# Altium project USB-IRIS-W1.PrjPcb
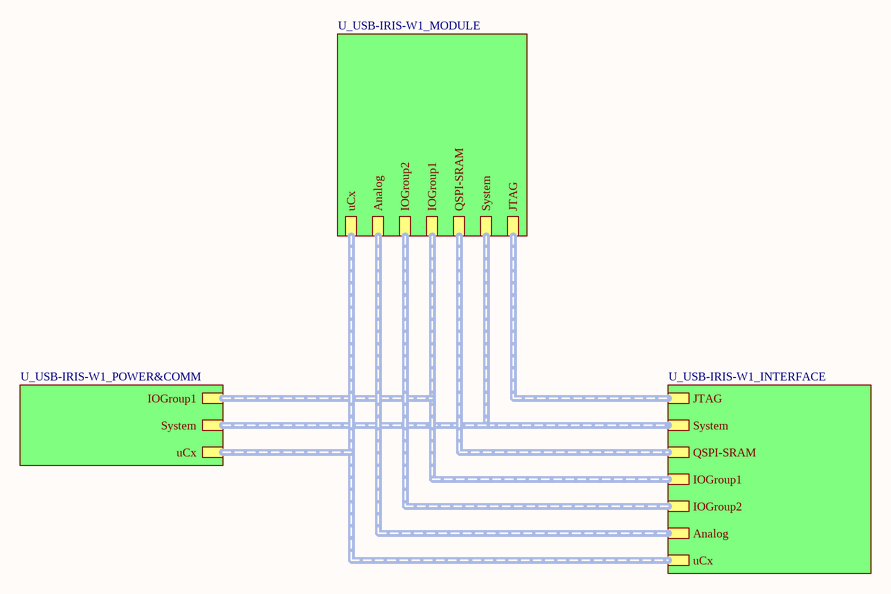
[diagram p0: USB-IRIS-W1_TOP_01.SchDoc]
SchUBXNum: UBXH66-000xxxx; SchSheetTotal: 4; SchDocNum: 4; ReleaseRev3: C; ReleaseRev2: B; ReleaseRev1: A; ReleaseDesc3: Corrected I2C-SCL and I2C-SDA connections at R5 and R18. 0201 to 0402.; ReleaseDesc2: Prototype Release; ReleaseDesc1: Prototype Release; ReleaseDate3: 2023-10-20; ReleaseDate2: 2023-06-02; ReleaseDate1: 2022-10-17; ReleaseBy3: lkis; ReleaseBy2: lkis; ReleaseBy1: lkis; ProjectEngineer: lkis; PCBUBXNum: UBXH60-0001068; PCBName: PCB-USB-IRIS-W1; PCBDocNum: UBXH60-0001068; GlobalReleaseDate: 2023-10-20; GlobalProjectTeam: ae-sho; GlobalProjectRevision: C; GlobalProjectName: USB-IRIS-W1; GlobalProjectLink: www.u-blox.com; GlobalProjectDescription: IRIS-W1 USB EVK Design; GlobalProjectCode: TE_IW1; GlobalCompanyName: u-blox AG; GlobalClientName: u-blox; AssemblyUBXNum: UBXH23-000xxxx
4 sheets, 87 parts. Net scope: hierarchical (ports join the sheet entries above them; power ports are global).
Board file: USB-IRIS-W1.PcbDoc
Sheets:
  USB-IRIS-W1_TOP_01.SchDoc
    U_USB-IRIS-W1_INTERFACE = USB-IRIS-W1_INTERFACE.SchDoc
    U_USB-IRIS-W1_MODULE = USB-IRIS-W1_MODULE.SchDoc
    U_USB-IRIS-W1_POWER&COMM = USB-IRIS-W1_POWER&COMM.SchDoc

## Sheet USB-IRIS-W1_TOP_01.SchDoc: PCB-USB-NORA-W1
size A3; Date: 09/17/2021; CompanyName: U-Blox; DrawnBy: ASOH/HEKF; Engineer: ASOH/HEKF; Organization: U-Blox; Address1: Östra Varvsgatan 4; Address2: SE-211 75 Malmo; DocumentNumber: 1; SheetNumber: 1; SheetTotal: 4; SheetSize: B; SheetTitle: TopSheet

### Sub-sheets
U_USB-IRIS-W1_INTERFACE = USB-IRIS-W1_INTERFACE.SchDoc: JTAG (harness JTAG), QSPI-SRAM (harness QSPI-SRAM), IOGroup2 (harness IOGroup2), Analog (harness Analog), uCx (harness uCx), IOGroup1 (harness IOGroup1), System (harness System)
U_USB-IRIS-W1_MODULE = USB-IRIS-W1_MODULE.SchDoc: JTAG (harness JTAG), QSPI-SRAM (harness QSPI-SRAM), IOGroup2 (harness IOGroup2), Analog (harness Analog), uCx (harness uCx), IOGroup1 (harness IOGroup1), System (harness System)
U_USB-IRIS-W1_POWER&COMM = USB-IRIS-W1_POWER&COMM.SchDoc: uCx (harness uCx), System (harness System), IOGroup1 (harness IOGroup1)

### Buses and harness runs
harness sheet U_USB-IRIS-W1_INTERFACE/Analog = sheet U_USB-IRIS-W1_MODULE/Analog
harness sheet U_USB-IRIS-W1_INTERFACE/IOGroup1 = sheet U_USB-IRIS-W1_MODULE/IOGroup1 = sheet U_USB-IRIS-W1_POWER&COMM/IOGroup1
harness sheet U_USB-IRIS-W1_INTERFACE/IOGroup2 = sheet U_USB-IRIS-W1_MODULE/IOGroup2
harness sheet U_USB-IRIS-W1_INTERFACE/JTAG = sheet U_USB-IRIS-W1_MODULE/JTAG
harness sheet U_USB-IRIS-W1_INTERFACE/QSPI-SRAM = sheet U_USB-IRIS-W1_MODULE/QSPI-SRAM
harness sheet U_USB-IRIS-W1_INTERFACE/System = sheet U_USB-IRIS-W1_MODULE/System = sheet U_USB-IRIS-W1_POWER&COMM/System
harness sheet U_USB-IRIS-W1_INTERFACE/uCx = sheet U_USB-IRIS-W1_MODULE/uCx = sheet U_USB-IRIS-W1_POWER&COMM/uCx

### Notes on the sheet
- Rev.
- Description
- Schematic/Assembly Revision
- Date
- By
- Prepared By
- Revision:
- CONFIDENTIAL
- Page:
- Size:
- A3

## Sheet USB-IRIS-W1_INTERFACE.SchDoc
size A3; Date: 7/24/2020; CompanyName: U-blox; DrawnBy: EMOO; Engineer: EMOO; Organization: U-blox; Address1: 3950 Fairview Industrial Dr SE #100; Address2: Salem, OR 97302; DocumentNumber: 3; SheetNumber: 3; SheetTotal: 4; SheetSize: B; SheetTitle: Connectors
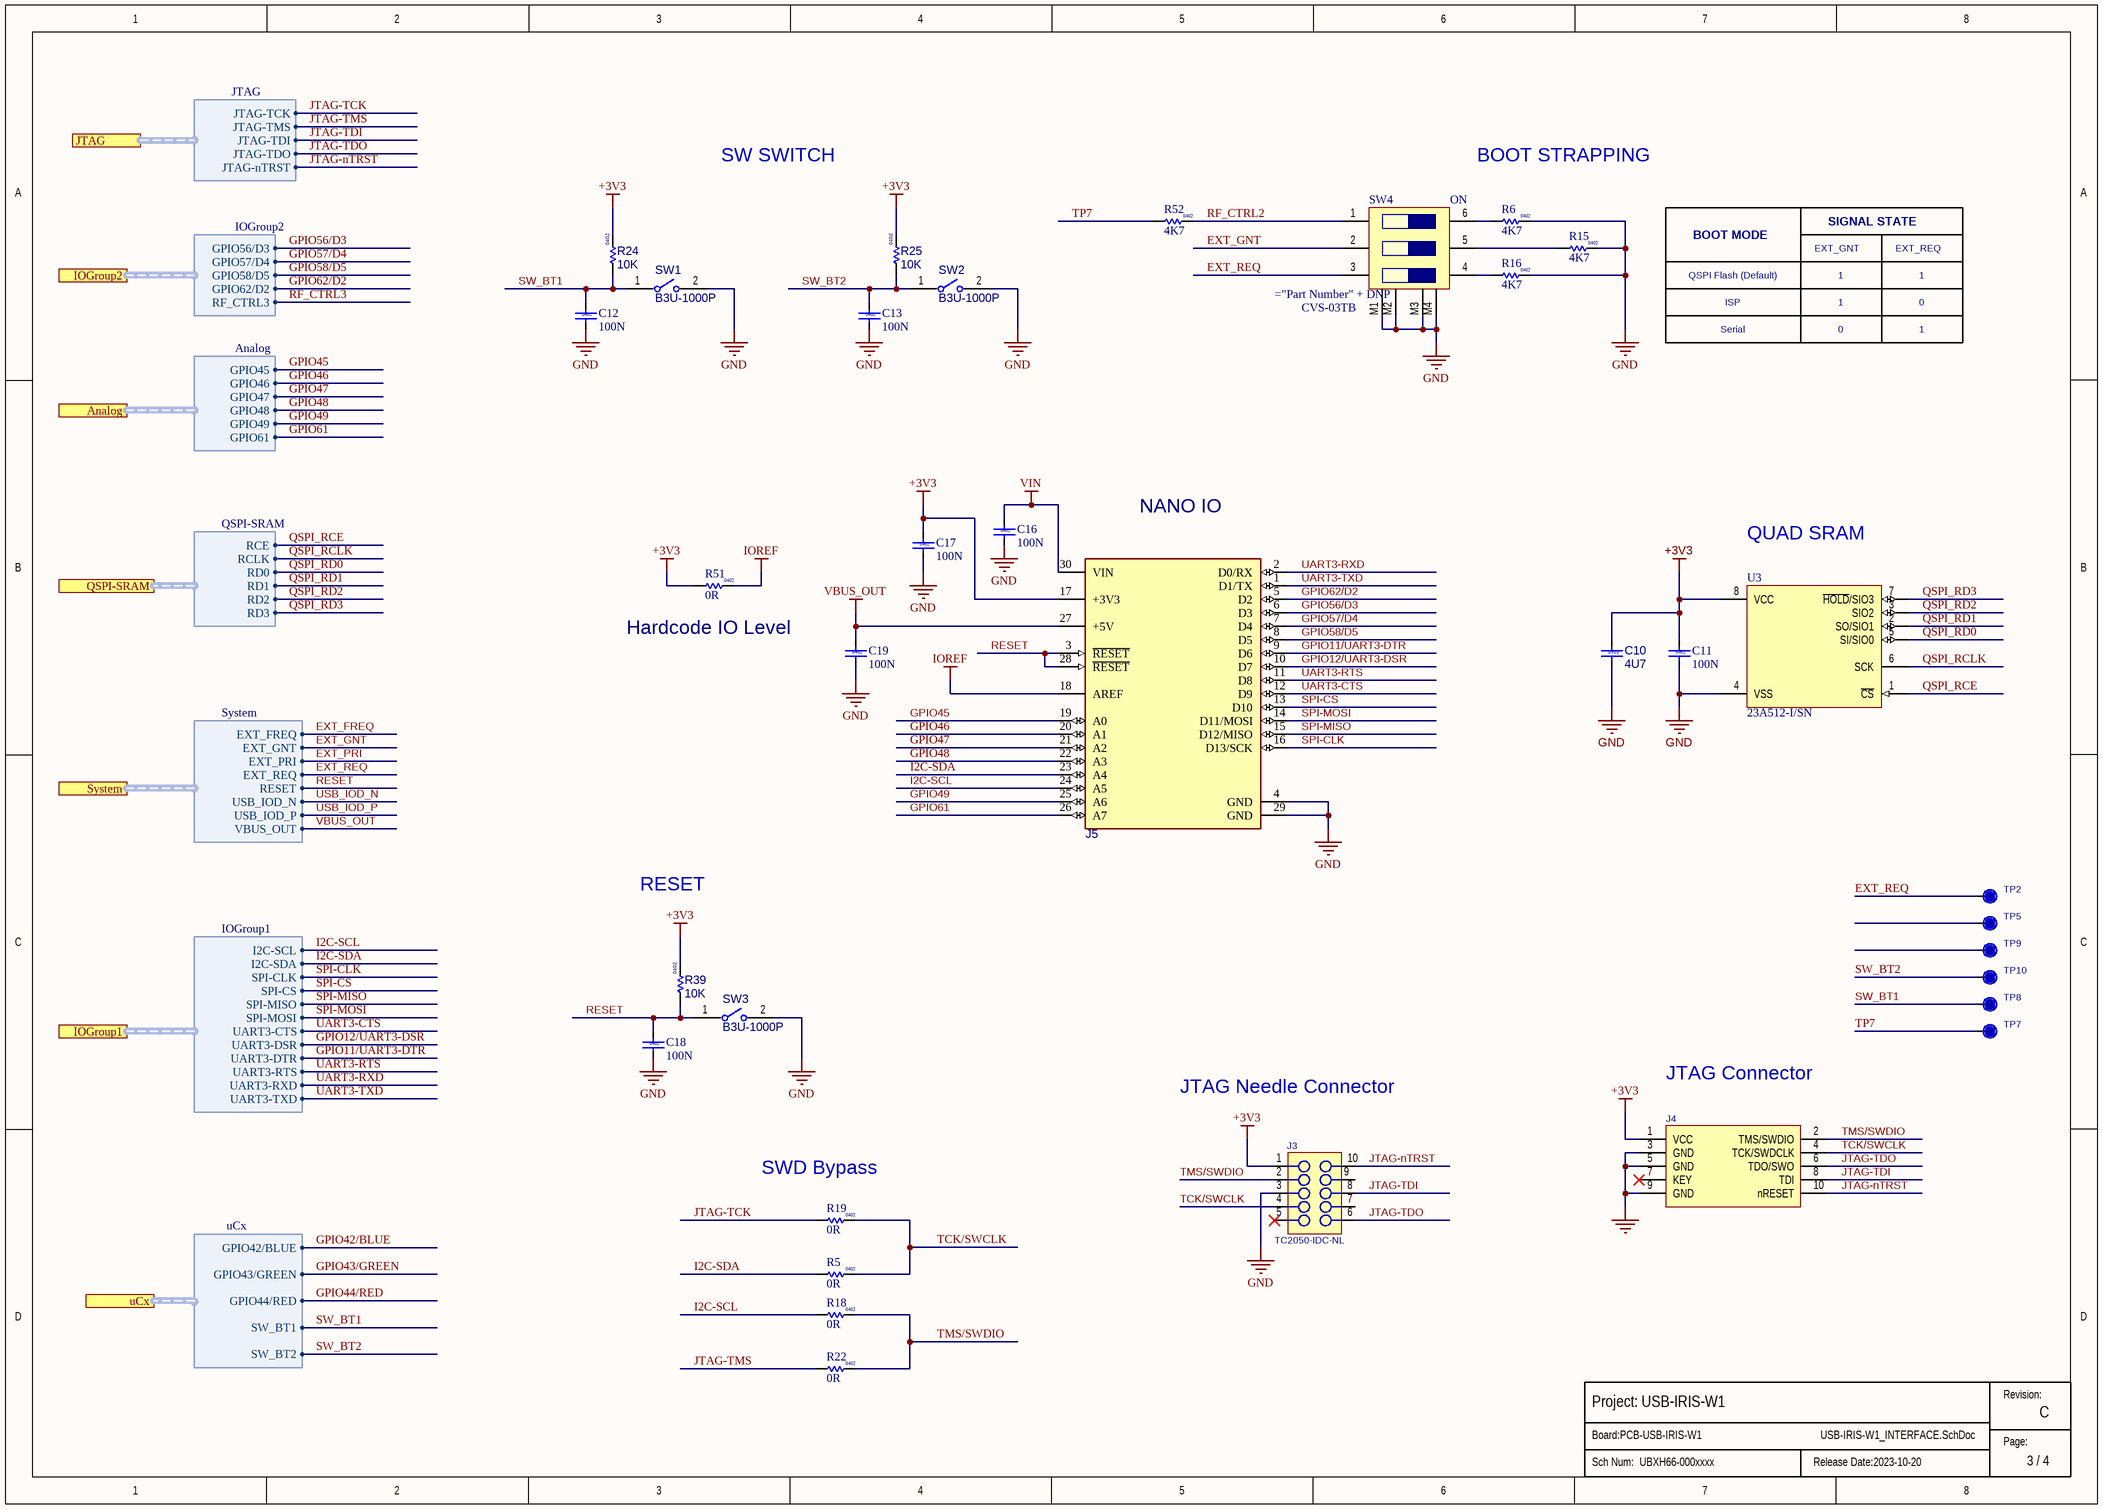
[diagram p1: USB-IRIS-W1_INTERFACE.SchDoc]

### Parts
C10  value 4U7  Size: 0x0y  [Cap 0402 HD]  (no BOM)
C11  value 100N  Size: 0402  [Cap 0402 HD]
C12  value 100N  Size: 0402  [Cap 0402]
C13  value 100N  Size: 0402  [Cap 0402]
C16  value 100N  Size: 0402  [Cap 0402 HD]
C17  value 100N  Size: 0402  [Cap 0402 HD]
C18  value 100N  Size: 0402  [Cap 0402]
C19  value 100N  Size: 0402  [Cap 0402 HD]
J3  TC2050-IDC-NLDNP  [TC2050-IDC-NL]  (value not drawn)  (no BOM)
J4  130-00099  [HDR.050P-10Pin-2x5-SMT_Key]  (value not drawn)
J5  UNK_Arduino  [UNK_Arduino]  (value not drawn)
R5  value 0R  Size: 0402  [RES_0402_1100Lx600Wx400H_500x600Pad_400G_FLX]
R6  value 4K7  Size: 0402  [RES_0402_1100Lx600Wx400H_500x600Pad_400G_FLX]
R15  value 4K7  Size: 0402  [RES_0402_1100Lx600Wx400H_500x600Pad_400G_FLX]
R16  value 4K7  Size: 0402  [RES_0402_1100Lx600Wx400H_500x600Pad_400G_FLX]
R18  value 0R  Size: 0402  [RES_0402_1100Lx600Wx400H_500x600Pad_400G_FLX]
R19  value 0R  Size: 0402  [RES_0402_1100Lx600Wx400H_500x600Pad_400G_FLX]
R22  value 0R  Size: 0402  [RES_0402_1100Lx600Wx400H_500x600Pad_400G_FLX]
R24  value 10K  Size: 0402  [RES 0402 HD]
R25  value 10K  Size: 0402  [RES 0402 HD]
R39  value 10K  Size: 0402  [RES 0402 HD]
R51  value 0R  Size: 0402  [RES_0402_1100Lx600Wx400H_500x600Pad_400G_FLX]
R52  value 4K7  Size: 0402  [RES_0402_1100Lx600Wx400H_500x600Pad_400G_FLX]
SW1  B3U-1000P  [FP-B3U-1000P-MFG]
SW2  B3U-1000P  [FP-B3U-1000P-MFG]
SW3  B3U-1000P  [FP-B3U-1000P-MFG]
SW4  (no value)  [CVS-03]
TP2  TP  [TP10R]  (value not drawn)  (no BOM)
TP5  TP  [TP10R]  (value not drawn)  (no BOM)
TP7  TP  [TP10R]  (value not drawn)  (no BOM)
TP8  TP  [TP10R]  (value not drawn)  (no BOM)
TP9  TP  [TP10R]  (value not drawn)  (no BOM)
TP10  TP  [TP10R]  (value not drawn)  (no BOM)
U3  23A512-I/SN  [SOIC127P599X173-8N]  (no BOM)

### Ports
Analog (harness Analog), IOGroup1 (harness IOGroup1), IOGroup2 (harness IOGroup2), JTAG (harness JTAG), QSPI-SRAM (harness QSPI-SRAM), System (harness System), uCx (harness uCx)

### Harnesses
JTAG: JTAG-TCK, JTAG-TMS, JTAG-TDI, JTAG-TDO, JTAG-nTRST
QSPI-SRAM: RCE, RCLK, RD0, RD1, RD2, RD3
IOGroup2: GPIO56/D3, GPIO57/D4, GPIO58/D5, GPIO62/D2, RF_CTRL3
Analog: GPIO45, GPIO46, GPIO47, GPIO48, GPIO49, GPIO61
uCx: GPIO42/BLUE, GPIO43/GREEN, GPIO44/RED, SW_BT1, SW_BT2
IOGroup1: I2C-SCL, I2C-SDA, SPI-CLK, SPI-CS, SPI-MISO, SPI-MOSI, UART3-CTS, UART3-DSR, UART3-DTR, UART3-RTS, UART3-RXD, UART3-TXD
System: EXT_FREQ, EXT_GNT, EXT_PRI, EXT_REQ, RESET, USB_IOD_N, USB_IOD_P, VBUS_OUT

### Nets
+3V3: C10.1 C11.1 C17.1 J3.1 J4.1(VCC) J5.17(+3V3) R24.2 R25.2 R39.2 R51.1 U3.8(VCC)
GND: C10.2 C11.2 C12.2 C13.2 C16.2 C17.2 C18.2 C19.2 J3.3 J4.3(GND) J4.5(GND) J4.9(GND) J5.4(GND) J5.29(GND) R6.2 R15.2 R16.2 SW1.2 SW2.2 SW3.2 SW4.M1 SW4.M2 SW4.M3 SW4.M4 U3.4(VSS)
IOREF: J5.18(AREF) R51.2
VBUS_OUT: C19.1 J5.27(+5V) ; port System.VBUS_OUT
VIN: C16.1 J5.30(VIN)
EXT_GNT: SW4.2 ; port System.EXT_GNT
EXT_REQ: SW4.3 TP2.1 ; port System.EXT_REQ
GPIO11/UART3-DTR: J5.9(D6) ; port IOGroup1.UART3-DTR
GPIO12/UART3-DSR: J5.10(D7) ; port IOGroup1.UART3-DSR
GPIO45: J5.19(A0) ; port Analog.GPIO45
GPIO46: J5.20(A1) ; port Analog.GPIO46
GPIO47: J5.21(A2) ; port Analog.GPIO47
GPIO48: J5.22(A3) ; port Analog.GPIO48
GPIO49: J5.25(A6) ; port Analog.GPIO49
GPIO56/D3: J5.6(D3) ; port IOGroup2.GPIO56/D3
GPIO57/D4: J5.7(D4) ; port IOGroup2.GPIO57/D4
GPIO58/D5: J5.8(D5) ; port IOGroup2.GPIO58/D5
GPIO61: J5.26(A7) ; port Analog.GPIO61
GPIO62/D2: J5.5(D2) ; port IOGroup2.GPIO62/D2
I2C-SCL: J5.24(A5) R18.1 ; port IOGroup1.I2C-SCL
I2C-SDA: J5.23(A4) R5.1 ; port IOGroup1.I2C-SDA
JTAG-nTRST: J3.10 J4.10(nRESET) ; port JTAG.JTAG-nTRST
JTAG-TCK: R19.1 ; port JTAG.JTAG-TCK
JTAG-TDI: J3.8 J4.8(TDI) ; port JTAG.JTAG-TDI
JTAG-TDO: J3.6 J4.6(TDO/SWO) ; port JTAG.JTAG-TDO
JTAG-TMS: R22.1 ; port JTAG.JTAG-TMS
QSPI_RCE: U3.1(~{CS}) ; port QSPI-SRAM.RCE
QSPI_RCLK: U3.6(SCK) ; port QSPI-SRAM.RCLK
QSPI_RD0: U3.5(SI/SIO0) ; port QSPI-SRAM.RD0
QSPI_RD1: U3.2(SO/SIO1) ; port QSPI-SRAM.RD1
QSPI_RD2: U3.3(SIO2) ; port QSPI-SRAM.RD2
QSPI_RD3: U3.7(~{HOLD}/SIO3) ; port QSPI-SRAM.RD3
RESET: C18.1 J5.3(~{RESET}) J5.28(~{RESET}) R39.1 SW3.1 ; port System.RESET
RF_CTRL2: R52.2 SW4.1
SPI-CLK: J5.16(D13/SCK) ; port IOGroup1.SPI-CLK
SPI-CS: J5.13(D10) ; port IOGroup1.SPI-CS
SPI-MISO: J5.15(D12/MISO) ; port IOGroup1.SPI-MISO
SPI-MOSI: J5.14(D11/MOSI) ; port IOGroup1.SPI-MOSI
SW_BT1: C12.1 R24.1 SW1.1 TP8.1 ; port uCx.SW_BT1
SW_BT2: C13.1 R25.1 SW2.1 TP10.1 ; port uCx.SW_BT2
TCK/SWCLK: J3.4 J4.4(TCK/SWDCLK) R5.2 R19.2
TMS/SWDIO: J3.2 J4.2(TMS/SWDIO) R18.2 R22.2
TP7: R52.1 TP7.1
UART3-CTS: J5.12(D9) ; port IOGroup1.UART3-CTS
UART3-RTS: J5.11(D8) ; port IOGroup1.UART3-RTS
UART3-RXD: J5.2(D0/RX) ; port IOGroup1.UART3-RXD
UART3-TXD: J5.1(D1/TX) ; port IOGroup1.UART3-TXD
NetR6_1: R6.1 SW4.6
NetR15_1: R15.1 SW4.5
NetR16_1: R16.1 SW4.4

Not connected (* = marked no-connect by the designer): J3 5* 7 9; J4 7(KEY)*; TP5 1; TP9 1

### Notes on the sheet
- SW SWITCH
- BOOT STRAPPING
- BOOT MODE
- EXT_GNT
- SIGNAL STATE
- EXT_REQ
- QSPI Flash (Default)
- ISP
- 1
- 0
- Serial
- NANO IO
- QUAD SRAM
- (near R51) Hardcode IO Level
- RESET
- JTAG Needle Connector
- JTAG Connector
- (near R19) SWD Bypass
- Revision:
- Page:
- (in symbol CVS-03TB) ON

### Library data of the parts
C10 = UBXH01-0000243: CAP CER X5R 0402; Manufacturer: Murata Manufacturing Company, Ltd.; Manufacturer P/N: GRM155R61A475MEAA; Tolerance: 20%; Max Voltage: 10.0V; Editor: dario.antonaz; Released by: pasquale.scorca; Env: ROHS; Permitted Use: Volume Products; Perferred: PREF; Mfg P/N Status: Active; Mfg P/N Split: 100; Mfg P/N Released: Yes; Part Number: UBXH01-0000243; Min Operating Temp: -40°C; Max Operating Temp: 85°C; Part Type: Capacitor; Release Data: 2016-03-17 10:02:21.014314; UBX Wiki: https://wiki.u-blox.com/bin/view/Operations/PartDetails?index=24303; RefDes: C; Mfg P/N Datasheet: https://wiki.u-blox.com/bin/view/Generic/Docs/DocumentSummary?index=24302
C11-C13 C16-C19 = UBXH01-2021002: CAP CER X5R 0402 100N 10% 10V; Manufacturer: Murata Manufacturing Company, Ltd.; Manufacturer P/N: GRM155R61A104KA01; Editor: roland.rust; Env: GREEN; Permitted Use: Volume Products; Perferred: PREF; Mfg P/N Status: NRND; Mfg P/N Split: 100; Mfg P/N Released: Yes; Part Number: UBXH01-2021002; Tolerance: 10%; Max Voltage: 10V; Part Type: Capacitor; Released by: roland.rust; Release Data: 2005-07-22T13:59:44; UBX Wiki: https://wiki.u-blox.com/bin/view/Operations/PartDetails?index=5759; RefDes: C; Manufacturer 2: Samsung Electro-Mechanics; Manufacturer P/N 2: CL05A104KP5NNN; Mfg P/N Status 2: Active; Mfg P/N Split 2: 0; Mfg P/N Released 2: Yes; Mfg P/N Datasheet 2: https://wiki.u-blox.com/bin/view/Generic/Docs/DocumentSummary?index=28113
J3 = TC2050-IDC-NL: CON PADS FOR CBL PLUG-OF-NAILS 10-PIN NO LEGS; Manufacturer: TAG Connect; Added By: Paul B; Manufacturer P/N: TC2050-IDC-NL; Part Number: TC2050-IDC-NL; Size: 6.1mm x 9.9mm; Height: 0; DNP: DNP; Added Date: 12/3/2015
J4 = 130-00099: Header 0.05" 10Pin 2Row SMD Black; Part Name: CON HDR 0.05" 10Pin 2Row SMD Black; Part_Type: Connector; Manufacturer: Samtec; Manufacturer P/N: FTSH-105-01-F-DV-K; Item_Phase: Pre-Production; Component Mounting Type: SMT; Keyed: Yes; Locking: No; Pin Pitch: 0.050"; Rows: 2; Part Number: 130-00099; Revision: 1; Supplier 1: Digi-Key; Supplier Part Number 1: SAM8796-ND; Arena Link: https://app.bom.com/a/5N6EKRARATS7TSHL?v=spec.summary; Color: Black; Connector Type: Header; Height: 6mm; Length: 12.75mm; Pins: 10; Use in new designs: Yes; Width: 4.78
J5 = UBXH04-0000717: ARDUINO NANO 33 IOT CONN; Editor: aneeb.sohail; Env: ROHS; Permitted Use: Support Products; Perferred: PREF; Part Number: UBXH04-0000717; Min Operating Temp: -40°C; Max Operating Temp: 85°C; Part Type: Connector; UBX Wiki: https://wiki.u-blox.com/bin/view/Operations/PartDetails?index=35490; RefDes: J
R5 R18 R19 R22 R51 = UBXH18-0003002: RES THICK FILM CHIP 0402 0R 0 100mW; Manufacturer: KOA; Manufacturer P/N: RK73Z1ETTD; Tolerance: 0; Editor: charlotte.biber; Released by: peter.mueller; Env: ROHS; Permitted Use: Volume Products; Perferred: PREF; Mfg P/N Status: NRND; Mfg P/N Split: 100; Mfg P/N Released: Yes; Part Number: UBXH18-0003002; Max Power: 100mW; Part Type: Resistor; Release Data: 2012-06-05T09:49:55; UBX Wiki: https://wiki.u-blox.com/bin/view/Operations/PartDetails?index=6611; RefDes: R; Manufacturer 2: YAGEO; Manufacturer P/N 2: 2322_705_91001_L; Mfg P/N Status 2: Obsolete; Mfg P/N Split 2: 0; Mfg P/N Released 2: Yes
R6 R15 R16 R52 = UBXH18-0008065: RES THICK FILM CHIP 0402 4K7 5% 100mW; Manufacturer: YAGEO; Manufacturer P/N: 2322_705_70472_L; Editor: martin.frauchiger; Env: ROHS; Permitted Use: Volume Products; Perferred: PREF; Mfg P/N Status: NRND; Mfg P/N Split: 100; Mfg P/N Released: Yes; Part Number: UBXH18-0008065; Tolerance: 5%; Max Power: 100mW; Part Type: Resistor; Released by: martin.frauchiger; Release Data: 2005-08-19T10:42:45; UBX Wiki: https://wiki.u-blox.com/bin/view/Operations/PartDetails?index=6969; RefDes: R; Manufacturer 2: KOA; Manufacturer P/N 2: RK73B1ETTD472J; Mfg P/N Status 2: NRND; Mfg P/N Split 2: 0; Mfg P/N Released 2: Yes
R24 R25 R39 = UBXH18-0008073: RES THICK FILM CHIP 0402 10K 5% 100mW; Manufacturer: YAGEO; Manufacturer P/N: 2322_705_87103_L; Editor: martin.frauchiger; Env: ROHS; Permitted Use: Volume Products; Perferred: PREF; Mfg P/N Status: NRND; Mfg P/N Split: 0; Mfg P/N Released: Yes; Part Number: UBXH18-0008073; Tolerance: 5%; Max Power: 100mW; Part Type: Resistor; Released by: martin.frauchiger; Release Data: 2005-08-19 10:42:45; UBX Wiki: https://wiki.u-blox.com/bin/view/Operations/PartDetails?index=6981; RefDes: R
SW1-SW3 = CMP-2100-03586-2: SWITCH TACTILE SPST-NO 0.05A 12V; Contact Resistance: 100mR; Operating Force: 1.5N; Max Current Rating: 50mA; Switch Travel: 0.15mm; Actuator Type: Standard; Mechanical Life: 200000Cycles; Ratings: Dust Proof; Illumination Type: Non-Illuminated; Throw Configuration: SPST; Actuator Length: 0.4mm; Switch Function: Off-Mom; Height: 1.2mm; Width: 3mm; Weight: 0.000776oz; Contact Material: Silver; Max Voltage Rating (DC): 12V; Insulation Resistance: 100MR; Lead Free: Lead Free; Current Rating: 50mA; Termination: SMD/SMT; Length: 4mm; Voltage Rating (DC): 12V; Contact Current Rating: 50mA; Orientation: Straight; Depth: 2.5mm; Max Operating Temperature: 70°C; Packaging: Tape and Reel; Min Operating Temperature: -25°C; Package Quantity: 1; Mount: Surface Mount; Electrical Life: 200000Cycles
SW4 = CVS-03TB: Dip Switch SPST 3 Position Surface Mount Slide (Standard) Actuator 100mA 6VDC; Part Number: UBXH19-0000036; Manufacturer 1: Nidec Components Corporation; Item_Phase: Active; Component Mounting Type: SMT; Switch/Button Function: On-Off; Use in new designs: Yes; Voltage: 6V; Item Phase: Unreleased; UBX Code: None; Part Name: CVS-03TB; Part_Type: Switch; Revision: A; Supplier 1: Digi-Key; Supplier Part Number 1: 563-1194-1-ND; Arena Link: https://app.bom.com/a/4M5DJQ9Q9SR7OCE3?v=spec.summary; Current: 100mA; Height: 1.45mm; Length: 6.1mm; Pins: 6; Switch/Button Circuit: SPST; Width: 6.2mm; Max Operating Temp: 85; Min Operating Temp: -40; Manufacturer 2: None; Manufacturer Part Number 2: None; Supplier 2: None; Supplier Part Number 2: None; Manufacturer Part Number 1: CVS-03TB
TP2 TP5 TP7-TP10 = TP10R: Testpoint, Round 1.0mm Dia; Added By: Jeremy D; Part Number: TP10R; Size: 1.0mm; Height: 0; DNP: DNP; Added Date: 2/1/2015; Checked By: Paul B; Checked Date: 2/5/2015
U3 = 23A512-I/SN: IC SRAM 512KBIT SPI/QUAD 8SOIC; Manufacturer: Microchip Technology; Memory Size: 512kb; Memory Interface: Qaud SPI; Manufacturer Part Number: 23A512-I/SN; Technology: SRAM; Package / Case: 8-SOIC (0.154", 3.90mm Width); Supplier 1: Digi-Key; Supplier Part Number 1: 23A512-I/SN-ND

## Sheet USB-IRIS-W1_MODULE.SchDoc
size A3; Date: 7/24/2020; CompanyName: U-blox; DrawnBy: EMOO; Engineer: EMOO; Organization: U-blox; Address1: 3950 Fairview Industrial Dr SE #100; Address2: Salem, OR 97302; DocumentNumber: 3; SheetNumber: 4; SheetTotal: 4; SheetSize: B; SheetTitle: Connectors
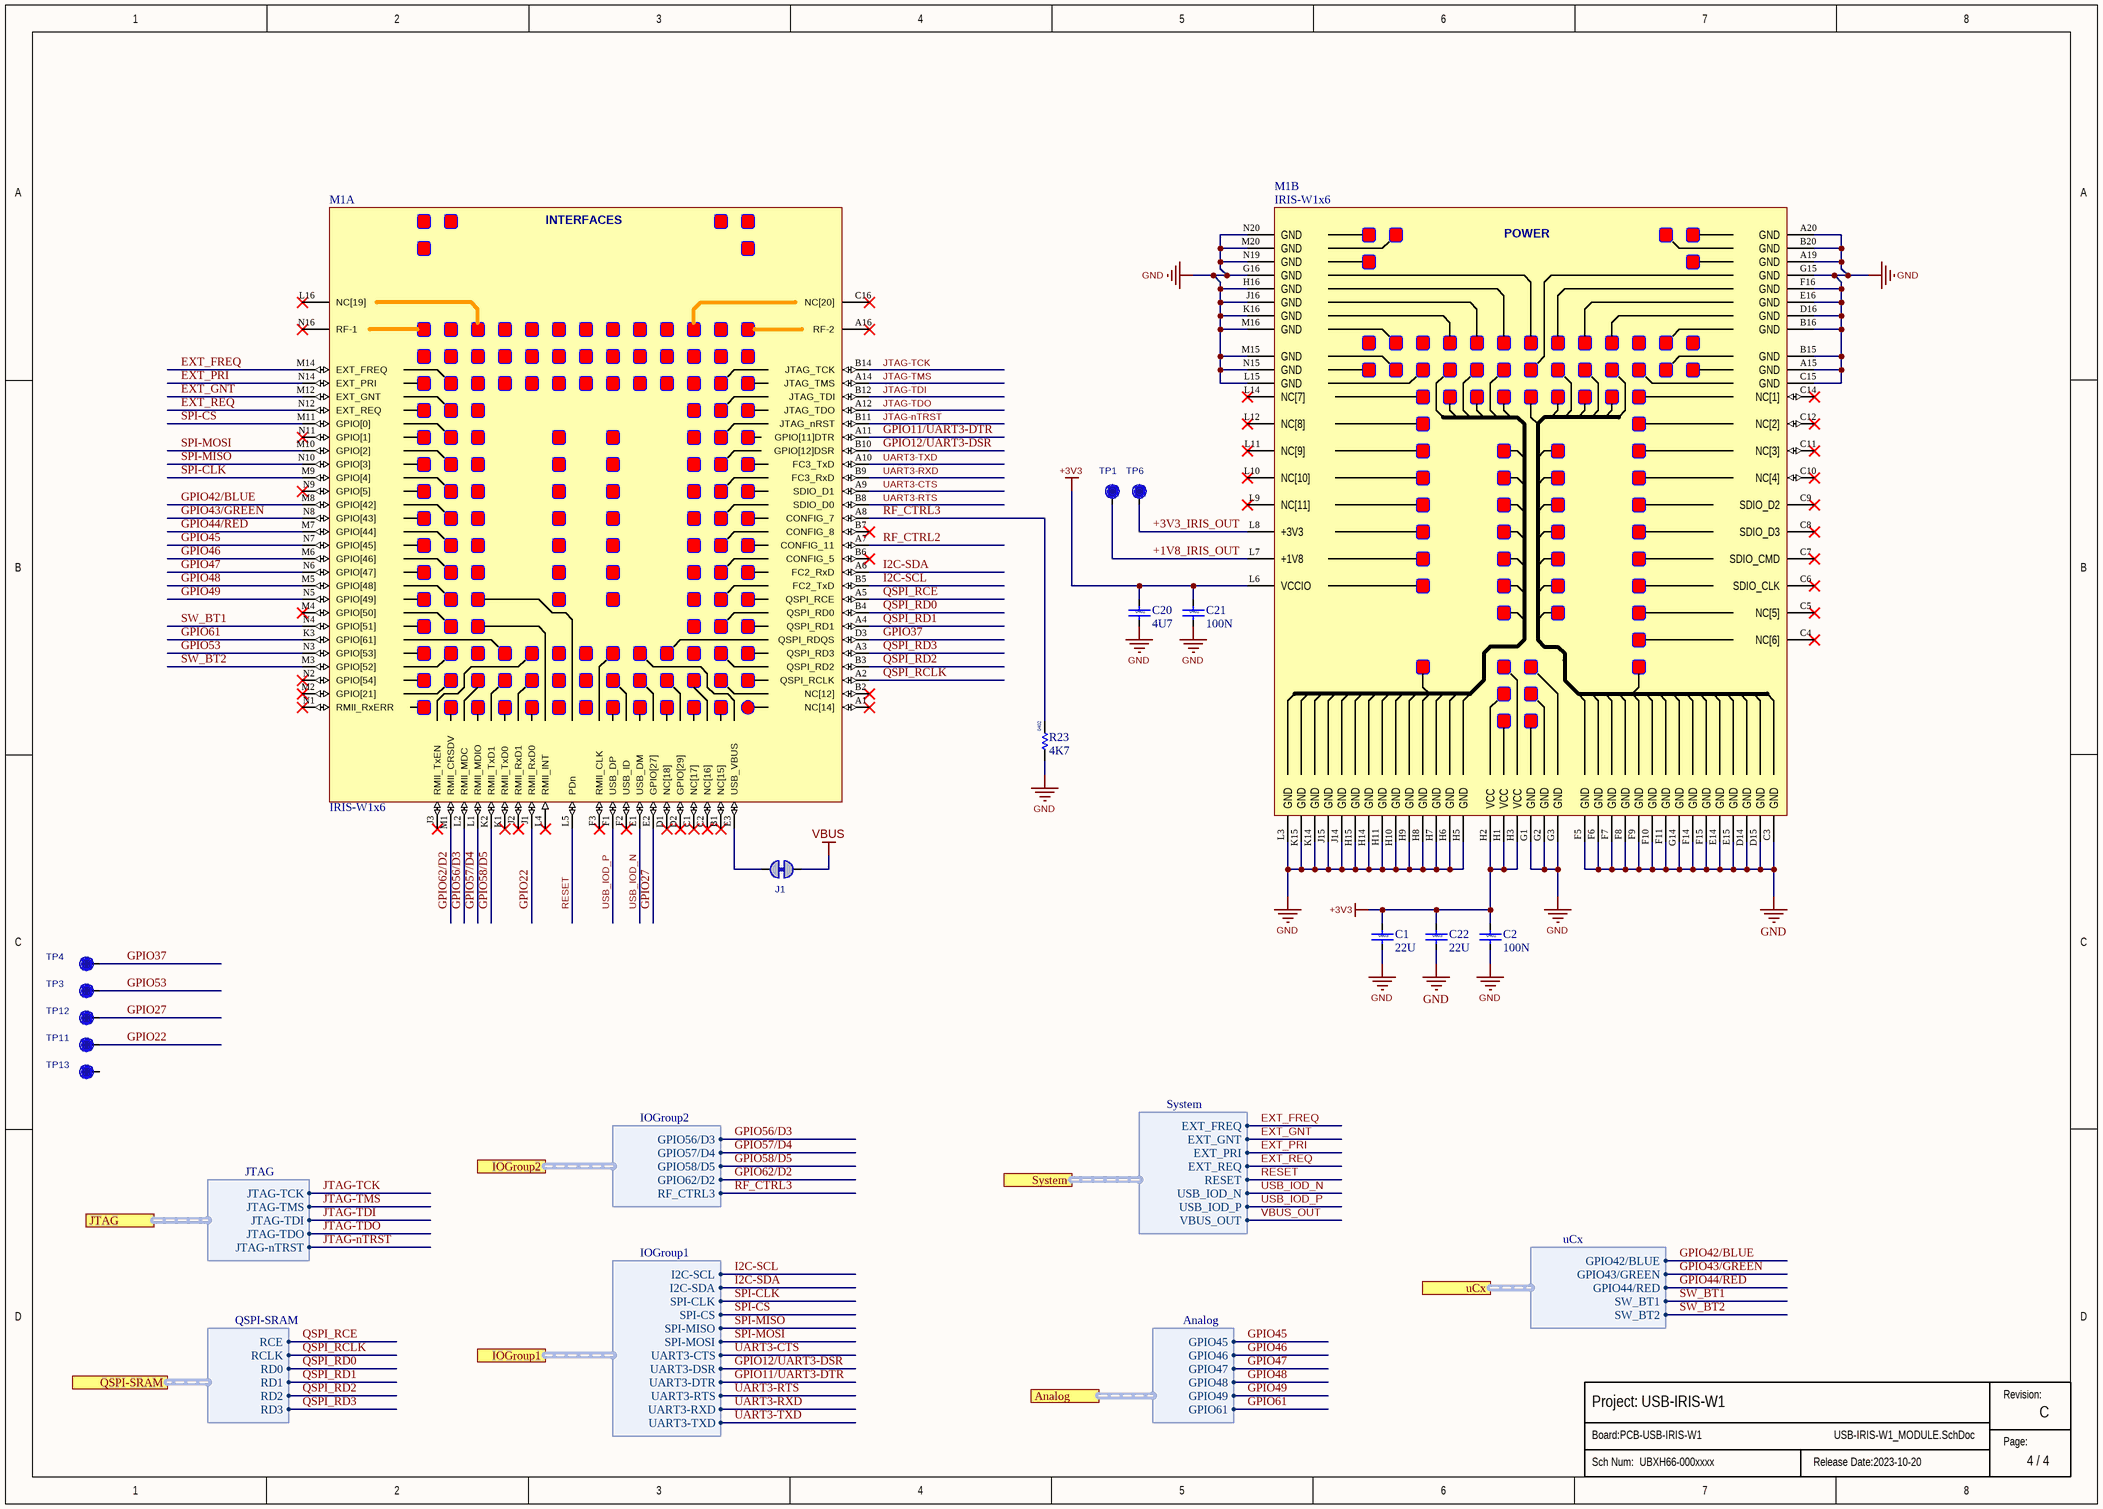
[diagram p2: USB-IRIS-W1_MODULE.SchDoc]

### Parts
C1  value 22U  Size: 0603  [Cap 0603]
C2  value 100N  Size: 0402  [Cap 0402 HD]
C20  value 4U7  Size: 0402  [Cap_0402_1200Lx700Wx700H_600x600Pad_350G_FLX]
C21  value 100N  Size: 0402  [Cap 0402 HD]
C22  value 22U  Size: 0603  [Cap 0603]
J1  Solderbridge-ShortDNP  [Solderbridge-Short]  (value not drawn)  (net tie, no BOM)
M1  IRIS-W1x6  [IRIS-W1x6_LGA152]  (parts A,B of 2)
R23  value 4K7  Size: 0402  [RES_0402_1100Lx600Wx400H_500x600Pad_400G_FLX]
TP1  TP  [TP10R]  (value not drawn)  (no BOM)
TP3  TP  [TP10R]  (value not drawn)  (no BOM)
TP4  TP  [TP10R]  (value not drawn)  (no BOM)
TP6  TP  [TP10R]  (value not drawn)  (no BOM)
TP11  TP  [TP10R]  (value not drawn)  (no BOM)
TP12  TP  [TP10R]  (value not drawn)  (no BOM)
TP13  TP  [TP10R]  (value not drawn)  (no BOM)

### Ports
Analog (harness Analog), IOGroup1 (harness IOGroup1), IOGroup2 (harness IOGroup2), JTAG (harness JTAG), QSPI-SRAM (harness QSPI-SRAM), System (harness System), uCx (harness uCx)

### Harnesses
JTAG: JTAG-TCK, JTAG-TMS, JTAG-TDI, JTAG-TDO, JTAG-nTRST
QSPI-SRAM: RCE, RCLK, RD0, RD1, RD2, RD3
Analog: GPIO45, GPIO46, GPIO47, GPIO48, GPIO49, GPIO61
uCx: GPIO42/BLUE, GPIO43/GREEN, GPIO44/RED, SW_BT1, SW_BT2
IOGroup1: I2C-SCL, I2C-SDA, SPI-CLK, SPI-CS, SPI-MISO, SPI-MOSI, UART3-CTS, UART3-DSR, UART3-DTR, UART3-RTS, UART3-RXD, UART3-TXD
System: EXT_FREQ, EXT_GNT, EXT_PRI, EXT_REQ, RESET, USB_IOD_N, USB_IOD_P, VBUS_OUT
IOGroup2: GPIO56/D3, GPIO57/D4, GPIO58/D5, GPIO62/D2, RF_CTRL3

### Nets
+3V3: C1.1 C2.1 C20.1 C21.1 C22.1 M1.H1(VCC) M1.H2(VCC) M1.H3(VCC) M1.L6(VCCIO)
GND: C1.2 C2.2 C20.2 C21.2 C22.2 M1.A15(GND) M1.A19(GND) M1.A20(GND) M1.B15(GND) M1.B16(GND) M1.B20(GND) M1.C3(GND) M1.C15(GND) M1.D14(GND) M1.D15(GND) M1.D16(GND) M1.E14(GND) M1.E15(GND) M1.E16(GND) M1.F5(GND) M1.F6(GND) M1.F7(GND) M1.F8(GND) M1.F9(GND) M1.F10(GND) M1.F11(GND) M1.F14(GND) M1.F15(GND) M1.F16(GND) M1.G1(GND) M1.G2(GND) M1.G3(GND) M1.G14(GND) M1.G15(GND) M1.G16(GND) M1.H5(GND) M1.H6(GND) M1.H7(GND) M1.H8(GND) M1.H9(GND) M1.H10(GND) M1.H11(GND) M1.H14(GND) M1.H15(GND) M1.H16(GND) M1.J14(GND) M1.J15(GND) M1.J16(GND) M1.K14(GND) M1.K15(GND) M1.K16(GND) M1.L3(GND) M1.L15(GND) M1.M15(GND) M1.M16(GND) M1.M20(GND) M1.N15(GND) M1.N19(GND) M1.N20(GND) R23.1
VBUS: J1.1
+1V8_IRIS_OUT: M1.L7(+1V8) TP1.1
+3V3_IRIS_OUT: M1.L8(+3V3) TP6.1
EXT_FREQ: M1.M14(EXT_FREQ) ; port System.EXT_FREQ
EXT_GNT: M1.M12(EXT_GNT) ; port System.EXT_GNT
EXT_PRI: M1.N14(EXT_PRI) ; port System.EXT_PRI
EXT_REQ: M1.N12(EXT_REQ) ; port System.EXT_REQ
GPIO11/UART3-DTR: M1.A11(GPIO[11]DTR) ; port IOGroup1.UART3-DTR
GPIO12/UART3-DSR: M1.B10(GPIO[12]DSR) ; port IOGroup1.UART3-DSR
GPIO22: M1.J1(RMII_RxD0) TP11.1
GPIO27: M1.E2(GPIO[27]) TP12.1
GPIO37: M1.D3(QSPI_RDQS) TP4.1
GPIO42/BLUE: M1.M8(GPIO[42]) ; port uCx.GPIO42/BLUE
GPIO43/GREEN: M1.N8(GPIO[43]) ; port uCx.GPIO43/GREEN
GPIO44/RED: M1.M7(GPIO[44]) ; port uCx.GPIO44/RED
GPIO45: M1.N7(GPIO[45]) ; port Analog.GPIO45
GPIO46: M1.M6(GPIO[46]) ; port Analog.GPIO46
GPIO47: M1.N6(GPIO[47]) ; port Analog.GPIO47
GPIO48: M1.M5(GPIO[48]) ; port Analog.GPIO48
GPIO49: M1.N5(GPIO[49]) ; port Analog.GPIO49
GPIO53: M1.N3(GPIO[53]) TP3.1
GPIO56/D3: M1.L2(RMII_MDC) ; port IOGroup2.GPIO56/D3
GPIO57/D4: M1.L1(RMII_MDIO) ; port IOGroup2.GPIO57/D4
GPIO58/D5: M1.K2(RMII_TxD1) ; port IOGroup2.GPIO58/D5
GPIO61: M1.K3(GPIO[61]) ; port Analog.GPIO61
GPIO62/D2: M1.M1(RMII_CRSDV) ; port IOGroup2.GPIO62/D2
I2C-SCL: M1.B5(FC2_TxD) ; port IOGroup1.I2C-SCL
I2C-SDA: M1.A6(FC2_RxD) ; port IOGroup1.I2C-SDA
JTAG-nTRST: M1.B11(JTAG_nRST) ; port JTAG.JTAG-nTRST
JTAG-TCK: M1.B14(JTAG_TCK) ; port JTAG.JTAG-TCK
JTAG-TDI: M1.B12(JTAG_TDI) ; port JTAG.JTAG-TDI
JTAG-TDO: M1.A12(JTAG_TDO) ; port JTAG.JTAG-TDO
JTAG-TMS: M1.A14(JTAG_TMS) ; port JTAG.JTAG-TMS
QSPI_RCE: M1.A5(QSPI_RCE) ; port QSPI-SRAM.RCE
QSPI_RCLK: M1.A2(QSPI_RCLK) ; port QSPI-SRAM.RCLK
QSPI_RD0: M1.B4(QSPI_RD0) ; port QSPI-SRAM.RD0
QSPI_RD1: M1.A4(QSPI_RD1) ; port QSPI-SRAM.RD1
QSPI_RD2: M1.B3(QSPI_RD2) ; port QSPI-SRAM.RD2
QSPI_RD3: M1.A3(QSPI_RD3) ; port QSPI-SRAM.RD3
RESET: M1.L5(PDn) ; port System.RESET
RF_CTRL2: M1.A7(CONFIG_11)
RF_CTRL3: M1.A8(CONFIG_7) R23.2 ; port IOGroup2.RF_CTRL3
SPI-CLK: M1.M9(GPIO[4]) ; port IOGroup1.SPI-CLK
SPI-CS: M1.M11(GPIO[0]) ; port IOGroup1.SPI-CS
SPI-MISO: M1.N10(GPIO[3]) ; port IOGroup1.SPI-MISO
SPI-MOSI: M1.M10(GPIO[2]) ; port IOGroup1.SPI-MOSI
SW_BT1: M1.N4(GPIO[51]) ; port uCx.SW_BT1
SW_BT2: M1.M3(GPIO[52]) ; port uCx.SW_BT2
UART3-CTS: M1.A9(SDIO_D1) ; port IOGroup1.UART3-CTS
UART3-RTS: M1.B8(SDIO_D0) ; port IOGroup1.UART3-RTS
UART3-RXD: M1.B9(FC3_RxD) ; port IOGroup1.UART3-RXD
UART3-TXD: M1.A10(FC3_TxD) ; port IOGroup1.UART3-TXD
USB_IOD_N: M1.E1(USB_DM) ; port System.USB_IOD_N
USB_IOD_P: M1.F1(USB_DP) ; port System.USB_IOD_P
NetJ1_2: J1.2 M1.E3(USB_VBUS)

Not connected (* = marked no-connect by the designer): M1 A1(NC[14])* A16(RF-2)* B1(NC[15])* B2(NC[12])* B6(CONFIG_5)* B7(CONFIG_8)* C1(NC[17])* C2(NC[16])* C4(NC[6])* C5(NC[5])* C6(SDIO_CLK)* C7(SDIO_CMD)* C8(SDIO_D3)* C9(SDIO_D2)* C10(NC[4])* C11(NC[3])* C12(NC[2])* C14(NC[1])* C16(NC[20])* D1(NC[18])* D2(GPIO[29])* F2(USB_ID)* F3(RMII_CLK)* J2(RMII_RxD1)* J3(RMII_TxEN)* K1(RMII_TxD0)* L4(RMII_INT)* L9(NC[11])* L10(NC[10])* L11(NC[9])* L12(NC[8])* L14(NC[7])* L16(NC[19])* M2(GPIO[21])* M4(GPIO[50])* N1(RMII_RxERR)* N2(GPIO[54])* N9(GPIO[5])* N11(GPIO[1])* N16(RF-1)*; TP13 1

### Notes on the sheet
- Revision:
- Page:
- (in symbol UBXH14-0000681, part A) INTERFACES
- (in symbol UBXH14-0000681, part B) POWER

### Library data of the parts
C1 C22 = UBXH01-0000150: CAP CER X5R 0603 22U 20% 10V; Manufacturer: Murata Manufacturing Company, Ltd.; Manufacturer P/N: GRM188R61A226ME15D; Editor: dario.antonaz; Released by: pasquale.scorca; Env: ROHS; Permitted Use: Volume Products; Perferred: PREF; Mfg P/N Status: Active; Mfg P/N Split: 100; Mfg P/N Released: Yes; Part Number: UBXH01-0000150; Tolerance: 20%; Max Voltage: 10V; Part Type: Capacitor; Release Data: 2016-03-09T11:21:55; UBX Wiki: https://wiki.u-blox.com/bin/view/Operations/PartDetails?index=21275; RefDes: C; Mfg P/N Datasheet: https://wiki.u-blox.com/bin/view/Generic/Docs/DocumentSummary?index=21277
C2 C21 = UBXH01-2021002: as C11 on sheet USB-IRIS-W1_INTERFACE; Part Number: UBXH01-2021002; Tolerance: 10%; Max Voltage: 10V; Part Type: Capacitor; Released by: roland.rust; Release Data: 2005-07-22T13:59:44; UBX Wiki: https://wiki.u-blox.com/bin/view/Operations/PartDetails?index=5759; RefDes: C; Manufacturer 2: Samsung Electro-Mechanics; Manufacturer P/N 2: CL05A104KP5NNN; Mfg P/N Status 2: Active; Mfg P/N Split 2: 0; Mfg P/N Released 2: Yes; Mfg P/N Datasheet 2: https://wiki.u-blox.com/bin/view/Generic/Docs/DocumentSummary?index=28113
C20 = UBXH01-0000243: CAP CER X5R 0402 4U7 20% 10V; Manufacturer: Murata Manufacturing Company, Ltd.; Manufacturer P/N: GRM155R61A475MEAA; Editor: martin.pilik; Released by: fabrice.bret-dibat; Env: GREEN; Permitted Use: Volume Products; Perferred: PREF; Mfg P/N Status: Active; Mfg P/N Split: 100; Mfg P/N Released: Yes; Part Number: UBXH01-0000243; Tolerance: 20%; Max Voltage: 10V; Min Operating Temp: -40°C; Max Operating Temp: 85°C; Part Type: Capacitor; Release Data: 2021-05-10T12:57:47; UBX Wiki: https://wiki.u-blox.com/bin/view/Operations/PartDetails?index=24303; RefDes: C; Mfg P/N Datasheet: https://wiki.u-blox.com/bin/view/Generic/Docs/DocumentSummary?index=24302
J1 = Solderbridge-Short: Added By: Paul B; Part Number: Solderbridge-Short; Height: 0; DNP: DNP; Added Date: 12/2/2015
M1 = UBXH14-0000681: SHORT RANGE STAND-ALONE MULTIRADIO MODULE U-BLOX IRIS-W106; Editor: olof.viklund; Env: ROHS; Permitted Use: Volume Products; Perferred: PREF; Part Number: UBXH14-0000681; Min Operating Temp: -40°C; Max Operating Temp: 85°C; Part Type: RF; UBX Wiki: https://wiki.u-blox.com/bin/view/Operations/PartDetails?index=38240; RefDes: A
R23 = UBXH18-0008065: as R6 on sheet USB-IRIS-W1_INTERFACE; Part Number: UBXH18-0008065; Tolerance: 5%; Max Power: 100mW; Part Type: Resistor; Released by: martin.frauchiger; Release Data: 2005-08-19T10:42:45; UBX Wiki: https://wiki.u-blox.com/bin/view/Operations/PartDetails?index=6969; RefDes: R; Manufacturer 2: KOA; Manufacturer P/N 2: RK73B1ETTD472J; Mfg P/N Status 2: NRND; Mfg P/N Split 2: 0; Mfg P/N Released 2: Yes
TP1 TP3 TP4 TP6 TP11-TP13 = TP10R: as TP2 on sheet USB-IRIS-W1_INTERFACE; Part Number: TP10R; Size: 1.0mm; Height: 0; DNP: DNP; Added Date: 2/1/2015; Checked By: Paul B; Checked Date: 2/5/2015

## Sheet USB-IRIS-W1_POWER&COMM.SchDoc
size A3; Date: 7/24/2020; CompanyName: U-blox; DrawnBy: ASOH/HEKF; Engineer: ASOH/HEKF; Organization: U-blox; Address1: Östra Varvsgatan 4; Address2: SE-211 75 Malmo; DocumentNumber: 2; Revision: A; SheetNumber: 2; SheetTotal: 4; SheetSize: B; SheetTitle: Interface MCU
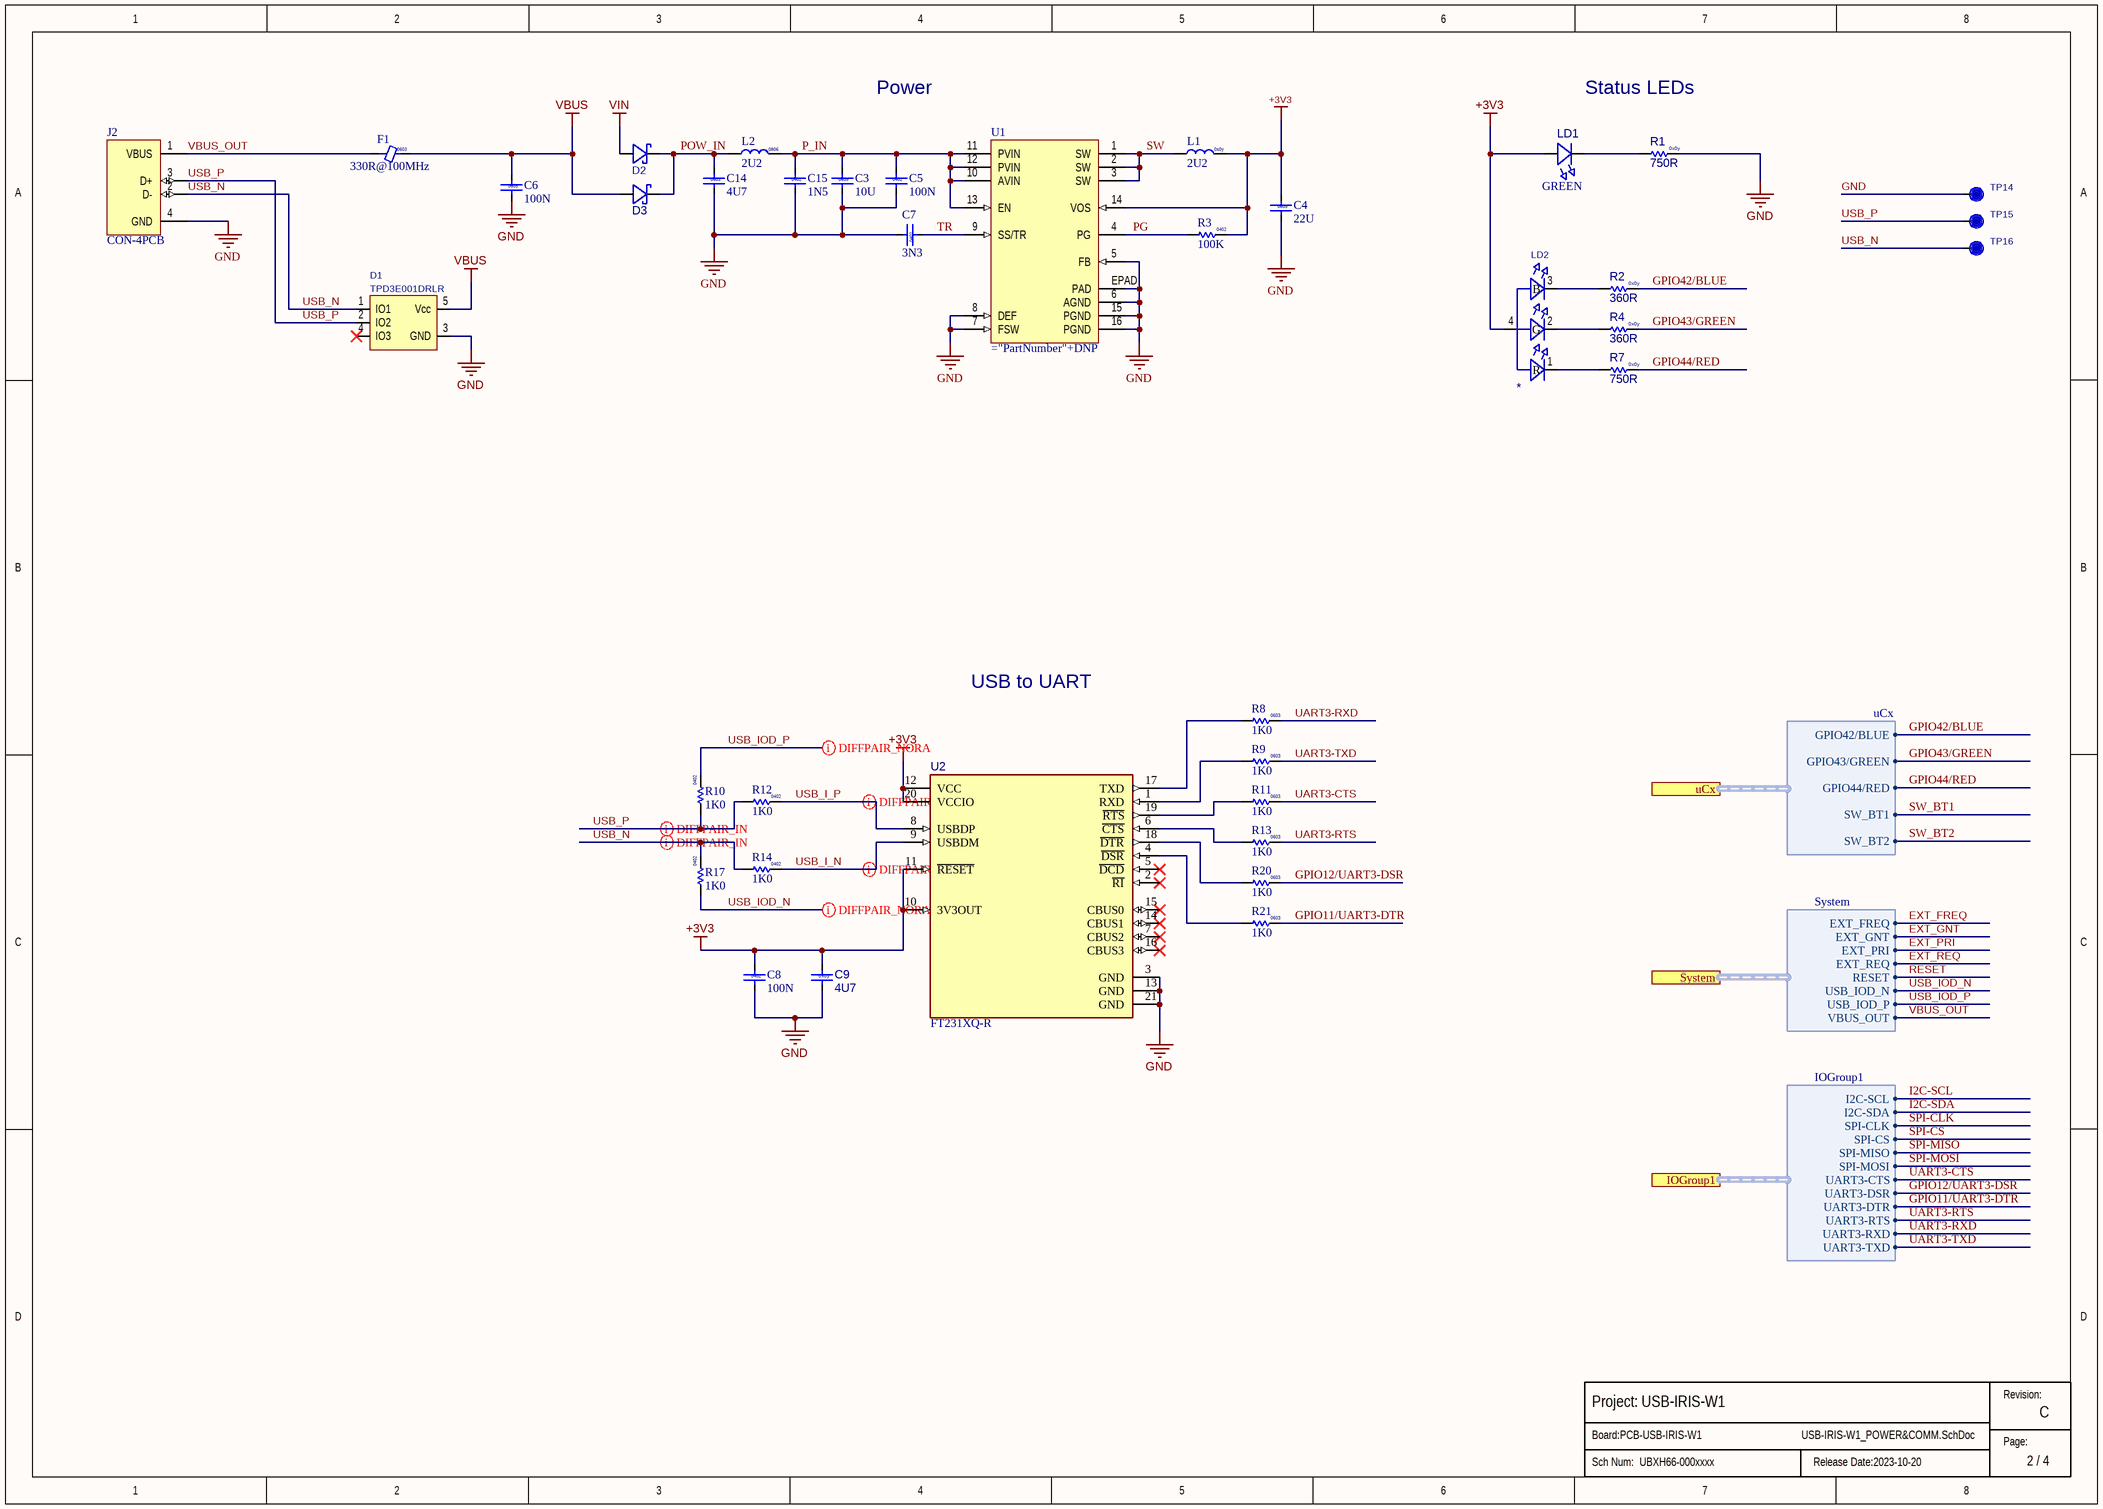
[diagram p3: USB-IRIS-W1_POWER&COMM.SchDoc]

### Parts
C3  value 10U  Size: 0805  [Cap 0805 HD]
C4  value 22U  Size: 0805  [Cap 0805 HD]
C5  value 100N  Size: 0402  [Cap 0402 HD]
C6  value 100N  Size: 0603  [CAP_0603_1750Lx950Wx850H_600x1000Pad_900G_FLX]
C7  value 3N3  Size: 0402  [CAP 0402]
C8  value 100N  Size: 0402  [Cap 0402 HD]
C9  value 4U7  Size: 0x0y  [Cap 0402 HD]
C14  value 4U7  Size: 0603  [CAP_0603_1800Lx1000Wx1000H_600x1000Pad_900G_FLX]
C15  value 1N5  Size: 0402  [CAP 0402]
D1  Manufacturer P/N: TPD3E001DRLR  [SOT-553]  (hidden comment: 110-00018)
D2  (no value)  [SOD-123F_U]
D3  (no value)  [SOD-123F_U]
F1  value 330R@100MHz  Size: 0603  [IND 0603 HD]
J2  CON-4PCB  [USB-A-PCB]
L1  value 2U2  Size: 0x0y  [Ind_4mmx4mm]
L2  value 2U2  Size: 0806  [IND 0806]
LD1  value GREEN  [LED-0603]
LD2  (no value)  [LED_1616]
R1  value 750R  Size: 0x0y  [RES 0402 HD]
R2  value 360R  Size: 0x0y  [RES 0402 HD]
R3  value 100K  Size: 0402  [RES 0402 HD]
R4  value 360R  Size: 0x0y  [RES 0402 HD]
R7  value 750R  Size: 0x0y  [RES 0402 HD]
R8  value 1K0  Size: 0603  [RES 0603 HD]
R9  value 1K0  Size: 0603  [RES 0603 HD]
R10  value 1K0  Size: 0402  [RES 0402 HD]
R11  value 1K0  Size: 0603  [RES 0603 HD]
R12  value 1K0  Size: 0402  [RES 0402 HD]
R13  value 1K0  Size: 0603  [RES 0603 HD]
R14  value 1K0  Size: 0402  [RES 0402 HD]
R17  value 1K0  Size: 0402  [RES 0402 HD]
R20  value 1K0  Size: 0603  [RES 0603 HD]
R21  value 1K0  Size: 0603  [RES 0603 HD]
TP14  TP  [TP10R]  (value not drawn)  (no BOM)
TP15  TP  [TP10R]  (value not drawn)  (no BOM)
TP16  TP  [TP10R]  (value not drawn)  (no BOM)
U1  (no value)  [QFN0.5P3x3-16Pin_W-Pad]
U2  FT231XQ-R  [QFN_5x5_FT231XQ]

### Ports
IOGroup1 (harness IOGroup1), System (harness System), uCx (harness uCx)

### Harnesses
uCx: GPIO42/BLUE, GPIO43/GREEN, GPIO44/RED, SW_BT1, SW_BT2
System: EXT_FREQ, EXT_GNT, EXT_PRI, EXT_REQ, RESET, USB_IOD_N, USB_IOD_P, VBUS_OUT
IOGroup1: I2C-SCL, I2C-SDA, SPI-CLK, SPI-CS, SPI-MISO, SPI-MOSI, UART3-CTS, UART3-DSR, UART3-DTR, UART3-RTS, UART3-RXD, UART3-TXD

### Nets
+3V3: C4.1 C8.1 C9.1 L1.2 LD1.2(A) LD2.4(A) R3.2 U1.14(VOS) U2.10(3V3OUT) U2.11(~{RESET}) U2.12(VCC) U2.20(VCCIO)
GND: C3.2 C4.2 C5.2 C6.2 C7.2 C8.2 C9.2 C14.2 C15.2 D1.3(GND) J2.4(GND) R1.2 TP14.1 U1.5(FB) U1.6(AGND) U1.7(FSW) U1.8(DEF) U1.15(PGND) U1.16(PGND) U1.EPAD(PAD) U2.3(GND) U2.13(GND) U2.21(GND)
VBUS: C6.1 D1.5(Vcc) D3.A(Anode) F1.2
VBUS_OUT: F1.1 J2.1(VBUS) ; port System.VBUS_OUT
VIN: D2.A(Anode)
GPIO11/UART3-DTR: R21.2 ; port IOGroup1.UART3-DTR
GPIO12/UART3-DSR: R20.2 ; port IOGroup1.UART3-DSR
GPIO42/BLUE: R2.2 ; port uCx.GPIO42/BLUE
GPIO43/GREEN: R4.2 ; port uCx.GPIO43/GREEN
GPIO44/RED: R7.2 ; port uCx.GPIO44/RED
P_IN: C3.1 C5.1 C15.1 L2.2 U1.10(AVIN) U1.11(PVIN) U1.12(PVIN) U1.13(EN)
PG: R3.1 U1.4(PG)
POW_IN: C14.1 D2.C(Cathode) D3.C(Cathode) L2.1
SW: L1.1 U1.1(SW) U1.2(SW) U1.3(SW)
TR: C7.1 U1.9(SS/TR)
UART3-CTS: R11.2 ; port IOGroup1.UART3-CTS
UART3-RTS: R13.2 ; port IOGroup1.UART3-RTS
UART3-RXD: R8.2 ; port IOGroup1.UART3-RXD
UART3-TXD: R9.2 ; port IOGroup1.UART3-TXD
USB_I_N: R14.2 U2.9(USBDM)
USB_I_P: R12.2 U2.8(USBDP)
USB_IOD_N: R17.1 ; port System.USB_IOD_N
USB_IOD_P: R10.2 ; port System.USB_IOD_P
USB_N: D1.1(IO1) J2.2(D-) R14.1 R17.2 TP16.1
USB_P: D1.2(IO2) J2.3(D+) R10.1 R12.1 TP15.1
NetLD1_1: LD1.1(C) R1.1
NetLD2_1: LD2.1(R) R7.1
NetLD2_2: LD2.2(G) R4.1
NetLD2_3: LD2.3(B) R2.1
NetR8_1: R8.1 U2.17(TXD)
NetR9_1: R9.1 U2.1(RXD)
NetR11_1: R11.1 U2.19(~{RTS})
NetR13_1: R13.1 U2.6(~{CTS})
NetR20_1: R20.1 U2.18(~{DTR})
NetR21_1: R21.1 U2.4(~{DSR})

Not connected (* = marked no-connect by the designer): D1 4(IO3)*; U2 2(~{RI})* 5(~{DCD})* 7(CBUS2)* 14(CBUS1)* 15(CBUS0)* 16(CBUS3)*

### Layout directives
differential pair; net class DIFF100: USB_I_N, USB_I_P, USB_IOD_N, USB_IOD_P, USB_N, USB_P

### Notes on the sheet
- Power
- Status LEDs
- USB to UART
- Revision:
- Page:

### Library data of the parts
C3 = UBXH01-0000261: CAP CER X5R 0805 10U 10% 25V; Manufacturer: Murata Manufacturing Company, Ltd.; Manufacturer P/N: GRM21BR61E106KA73; Editor: erian.bezhani; Released by: alex.claville; Env: ROHS; Permitted Use: Volume Products; Perferred: PREF; Mfg P/N Status: Active; Mfg P/N Split: 100; Mfg P/N Released: Yes; Part Number: UBXH01-0000261; Tolerance: 10%; Max Voltage: 25V; Part Type: Capacitor; Release Data: 2019-05-03T17:04:27; UBX Wiki: https://wiki.u-blox.com/bin/view/Operations/PartDetails?index=24683; RefDes: C
C4 = UBXH01-0000414: CAP CER X5R 0805 22U 20% 25V; Manufacturer: Murata Manufacturing Company, Ltd.; Manufacturer P/N: GRM21BR61E226ME44L; Editor: jaakko.jussila; Env: ROHS; Permitted Use: Support Products; Perferred: PREF; Mfg P/N Status: Active; Mfg P/N Split: 100; Mfg P/N Released: No; Part Number: UBXH01-0000414; Tolerance: 20%; Max Voltage: 25V; Min Operating Temp: -55°C; Max Operating Temp: 85°C; Part Type: Capacitor; UBX Wiki: https://wiki.u-blox.com/bin/view/Operations/PartDetails?index=30004; RefDes: C; Mfg P/N Datasheet: https://wiki.u-blox.com/bin/view/Generic/Docs/DocumentSummary?index=29981
C5 C8 = UBXH01-2021002: as C11 on sheet USB-IRIS-W1_INTERFACE; Part Number: UBXH01-2021002; Tolerance: 10%; Max Voltage: 10V; Part Type: Capacitor; Released by: roland.rust; Release Data: 2005-07-22T13:59:44; UBX Wiki: https://wiki.u-blox.com/bin/view/Operations/PartDetails?index=5759; RefDes: C; Manufacturer 2: Samsung Electro-Mechanics; Manufacturer P/N 2: CL05A104KP5NNN; Mfg P/N Status 2: Active; Mfg P/N Split 2: 0; Mfg P/N Released 2: Yes; Mfg P/N Datasheet 2: https://wiki.u-blox.com/bin/view/Generic/Docs/DocumentSummary?index=28113
C6 = UBXH01-2022001: CAP CER X7R 0603 100N 10% 50V; Manufacturer: Murata Manufacturing Company, Ltd.; Manufacturer P/N: GRM188R71H104KA93; Editor: andreas.thiel; Released by: johann.furrer; Env: ROHS; Permitted Use: Volume Products; Perferred: NONPREF; Mfg P/N Status: Obsolete; Mfg P/N Split: 100; Mfg P/N Released: Yes; Part Number: UBXH01-2022001; Tolerance: 10%; Max Voltage: 50V; Part Type: Capacitor; Release Data: 2010-04-01T16:00:29; UBX Wiki: https://wiki.u-blox.com/bin/view/Operations/PartDetails?index=5767; RefDes: C; Mfg P/N Datasheet: https://wiki.u-blox.com/bin/view/Generic/Docs/DocumentSummary?index=8644; Manufacturer 2: Samsung Electro-Mechanics; Manufacturer P/N 2: CL10B104KB8NFNC; Mfg P/N Status 2: Active; Mfg P/N Split 2: 0; Mfg P/N Released 2: Yes; Mfg P/N Datasheet 2: https://wiki.u-blox.com/bin/view/Generic/Docs/DocumentSummary?index=29478; Manufacturer 3: TDK Corporation; Manufacturer P/N 3: CGA3E2X7R1H104K080AA; Mfg P/N Status 3: Active; Mfg P/N Split 3: 0; Mfg P/N Released 3: Yes; Mfg P/N Datasheet 3: https://wiki.u-blox.com/bin/view/Generic/Docs/DocumentSummary?index=29486
C7 = UBXH01-0023019: CAP CER X7R 0402 3N3 10% 16V; Manufacturer: Murata Manufacturing Company, Ltd.; Manufacturer P/N: GRM155R71H332KA01; Editor: dario.antonaz; Released by: pierpaolo.arban; Env: ROHS; Permitted Use: Volume Products; Perferred: PREF; Mfg P/N Status: NRND; Mfg P/N Split: 100; Mfg P/N Released: Yes; Part Number: UBXH01-0023019; Tolerance: 10%; Max Voltage: 16V; Part Type: Capacitor; Release Data: 2013-08-21T12:21:41; UBX Wiki: https://wiki.u-blox.com/bin/view/Operations/PartDetails?index=5479; RefDes: C; Mfg P/N Datasheet: https://wiki.u-blox.com/bin/view/Generic/Docs/DocumentSummary?index=19430
C9 = UBXH01-0000243: as C10 on sheet USB-IRIS-W1_INTERFACE; Part Number: UBXH01-0000243; Min Operating Temp: -40°C; Max Operating Temp: 85°C; Part Type: Capacitor; Release Data: 2016-03-17 10:02:21.014314; UBX Wiki: https://wiki.u-blox.com/bin/view/Operations/PartDetails?index=24303; RefDes: C; Mfg P/N Datasheet: https://wiki.u-blox.com/bin/view/Generic/Docs/DocumentSummary?index=24302
C14 = UBXH01-0000247: CAP CER X5R 0603 4U7 20% 10V; Manufacturer: Murata Manufacturing Company, Ltd.; Manufacturer P/N: GRM185R61A475ME11; Editor: dario.antonaz; Released by: martin.grasse; Env: ROHS; Permitted Use: Volume Products; Perferred: PREF; Mfg P/N Status: NRND; Mfg P/N Split: 100; Mfg P/N Released: Yes; Part Number: UBXH01-0000247; Tolerance: 20%; Max Voltage: 10V; Min Operating Temp: -40°C; Max Operating Temp: 85°C; Part Type: Capacitor; Release Data: 2018-01-09T13:14:17; UBX Wiki: https://wiki.u-blox.com/bin/view/Operations/PartDetails?index=24365; RefDes: C; Mfg P/N Datasheet: https://wiki.u-blox.com/bin/view/Generic/Docs/DocumentSummary?index=24364
C15 = UBXH01-0000211: CAP CER X7R 0402 1N5 10% 50V; Manufacturer: Murata Manufacturing Company, Ltd.; Manufacturer P/N: GRM155R71H152KA01; Editor: domenico.volpe; Released by: massimo.vlacci; Env: ROHS; Permitted Use: Volume Products; Perferred: PREF; Mfg P/N Status: NRND; Mfg P/N Split: 100; Mfg P/N Released: Yes; Part Number: UBXH01-0000211; Tolerance: 10%; Max Voltage: 50V; Min Operating Temp: -55°C; Max Operating Temp: 125°C; Part Type: Capacitor; Release Data: 2015-11-04T16:43:52; UBX Wiki: https://wiki.u-blox.com/bin/view/Operations/PartDetails?index=23369; RefDes: C; Mfg P/N Datasheet: https://wiki.u-blox.com/bin/view/Generic/Docs/DocumentSummary?index=23371; Manufacturer 2: Samsung Electro-Mechanics; Manufacturer P/N 2: CL05B152KB5NNN; Mfg P/N Status 2: Active; Mfg P/N Split 2: 0; Mfg P/N Released 2: Yes; Mfg P/N Datasheet 2: https://wiki.u-blox.com/bin/view/Generic/Docs/DocumentSummary?index=23370
D1 = 110-00018: LOW-CAPACITANCE 3-CHANNEL ESD-PROTECTION ARRAY; Part Name: TVS Diode, 3CH High Speed ESD; Part_Type: Diode; Manufacturer: Texas Instruments; Item_Phase: Production; Body Size: 1.6mm x 1.2mm; Component Mounting Type: SMT; Diode Type: TVS; Use in new designs: Yes; Voltage: 5V; Part Number: 110-00018; Revision: 0A; Supplier 1: Digi-Key; Supplier Part Number 1: 296-21885-1-ND; Arena Link: https://app.bom.com/a/UCV39GZGZIHX50AE?v=spec.summary; Height: .55mm; MFG Package: SOT-553; Package Type: SOT; Pins: 5
D2 D3 = 110-00005: Diode, Schottky, 20V 1A SOD-123F, 340mV Vf @ 1A / MBR120VLSFT3G; Manufacturer 1: ON Semiconductor; Part Name: Diode Schottky 20V 1A SOD-123FL; Body Size: None; Item Phase: In Production; MFG Package: SOD-123FL; Use in new designs: Yes; Part Number: 110-00005; Manufacturer Part Number 1: MBR120VLSFT3G; Supplier 1: Digi-Key; Supplier Part Number 1: MBR120VLSFT3GOSCT-ND; Manufacturer 2: None; Manufacturer Part Number 2: None; Supplier 2: None; Supplier Part Number 2: None; Current: 1A; Height: 0.98mm; Max Operating Temp: 125; Min Operating Temp: -65; Pins: 2; Revision: 0B; Voltage: 20V; UBX Code: None
F1 = FB sm: FERRITE BEAD MURATA BLM18KG 0603 330R@100MHz; Manufacturer: Murata Electronics; Manufacturer P/N: BLM18KG331BH1D; Env: ROHS; Permitted Use: Volume Products; Perferred: PREF; Mfg P/N Status: Active; Mfg P/N Split: 100; Mfg P/N Released: Yes; Part Type: Ferrite; RefDes: FB
J2 = UBXH04-0000711: CONN USB PLUG A TYPE PCB FOOTPRINT; Editor: aneeb.sohail; Env: ROHS; Permitted Use: Support Products; Part Number: UBXH04-0000711; Part Type: Connector; UBX Wiki: https://wiki.u-blox.com/bin/view/Operations/PartDetails?index=35472; Perferred: N/A; RefDes: J
L1 = UBXH09-0000176: SHIELDED POWER INDUCTOR XFL4020 2U2 20% 3.1A; Manufacturer: Coilcraft; Manufacturer P/N: XFL4020-222ME; Editor: roland.rust; Released by: olof.viklund; Env: ROHS; Permitted Use: Support Products; Perferred: PREF; Mfg P/N Status: Active; Mfg P/N Split: 100; Mfg P/N Released: Yes; Part Number: UBXH09-0000176; Tolerance: 20%; Max Current: 3.1A; Min Operating Temp: -40°C; Max Operating Temp: 125°C; Part Type: Inductor; Release Data: 2015-06-17T10:51:21; UBX Wiki: https://wiki.u-blox.com/bin/view/Operations/PartDetails?index=22578; RefDes: L; Mfg P/N Datasheet: https://wiki.u-blox.com/bin/view/Generic/Docs/DocumentSummary?index=22577
L2 = UBXH09-0000025: IND MURATA LQM2MP 0806 2U2 30% 1.2A; Manufacturer: Murata Manufacturing Company, Ltd.; Manufacturer P/N: LQM2MPN2R2NG0; Editor: martin.pilik; Released by: fabrice.bret-dibat; Env: GREEN; Permitted Use: Volume Products; Perferred: PREF; Mfg P/N Status: Active; Mfg P/N Split: 100; Mfg P/N Released: Yes; Part Number: UBXH09-0000025; Tolerance: 30%; Max Current: 1.2A; Min Operating Temp: -55°C; Max Operating Temp: 125°C; Part Type: Inductor; Release Data: 2021-05-07T14:56:17; UBX Wiki: https://wiki.u-blox.com/bin/view/Operations/PartDetails?index=9109; RefDes: L; Mfg P/N Datasheet: https://wiki.u-blox.com/bin/view/Generic/Docs/DocumentSummary?index=9215
LD1 = UBXH11-0000018: LED CHIP 0603 LOW CURRENT OSRAM 0.002A; Manufacturer P/N: LG L29K-G2J1-24; Max Voltage: 2.2V; Max Current: 2mA; Editor: johann.furrer; Released by: martin.grasse; Env: ROHS; Permitted Use: Volume Products; Perferred: PREF; Mfg P/N Status: Active; Mfg P/N Split: 100; Mfg P/N Released: Yes; Color: *; Part Number: UBXH11-0000018; Min Operating Temp: -40°C; Max Operating Temp: 85°C; Part Type: LED; Release Data: 2018-01-09 15:31:38.754561; UBX Wiki: https://wiki.u-blox.com/bin/view/Operations/PartDetails?index=20619; RefDes: DS; Manufacturer: Osram; Mfg P/N Datasheet: https://wiki.u-blox.com/bin/view/Generic/Docs/DocumentSummary?index=20620
LD2 = 115-00026: LED RGB SMT 0606; Manufacturer 1: Lite-On Inc; Manufacturer Part Number 1: LTST-C19HE1WT; Body Size: 1.6mm x 1.6mm; Current: 20mA; Item Phase: In Production; MFG Package: 0606; Use in new designs: Yes; Voltage: None; Color: *; Part Number: 115-00026; Supplier 1: Digi-Key; Supplier Part Number 1: 160-2162-1-ND; Height: 0.35mm; Max Operating Temp: 80; Min Operating Temp: -20; Part Name: LED RGB SMT 0606; Pins: 4; Revision: 0B; Size: Other; UBX Code: None; Supplier 2: Digi-Key; Supplier Part Number 2: 1516-1184-1-ND
R1 R7 = UBXH18-0008046: RES THICK FILM CHIP 0402; Manufacturer: Panasonic; Manufacturer P/N: ERJ2GEJ751X; Tolerance: 5%; Max Power: 100mW; Editor: jaka.bevk; Released by: erian.bezhani; Env: ROHS; Permitted Use: Volume Products; Perferred: PREF; Mfg P/N Status: Active; Mfg P/N Split: 100; Mfg P/N Released: Yes; Part Number: UBXH18-0008046; Part Type: Resistor; Release Data: 2014-10-03 09:31:33.687559; UBX Wiki: https://wiki.u-blox.com/bin/view/Operations/PartDetails?index=6935; RefDes: R; Mfg P/N Datasheet: https://wiki.u-blox.com/bin/view/Generic/Docs/DocumentSummary?index=21267
R2 R4 = UBXH18-0000216: RES THICK FILM CHIP 0402; Manufacturer: KOA; Manufacturer P/N: RK73H1ETTP3600F; Tolerance: 1%; Max Power: 63mW; Editor: michael.hein; Released by: vasyl.dykyy; Env: ROHS; Permitted Use: Volume Products; Perferred: PREF; Mfg P/N Status: Active; Mfg P/N Split: 100; Mfg P/N Released: Yes; Part Number: UBXH18-0000216; Part Type: Resistor; Release Data: 2015-10-02 11:55:45.476057; Automotive: Yes; UBX Wiki: https://wiki.u-blox.com/bin/view/Operations/PartDetails?index=23306; RefDes: R; Mfg P/N Datasheet: https://wiki.u-blox.com/bin/view/Generic/Docs/DocumentSummary?index=8222
R3 = UBXH18-0000005: RES THICK FILM CHIP 0402 100K 1% 63mW; Manufacturer: KOA; Manufacturer P/N: RK73H1ETTP1003F; Editor: dario.antonaz; Released by: sandro.sestan; Env: ROHS; Permitted Use: Volume Products; Mfg P/N Status: Active; Mfg P/N Split: 100; Mfg P/N Released: Yes; Part Number: UBXH18-0000005; Tolerance: 1%; Max Power: 63mW; Part Type: Resistor; Release Data: 2009-11-30T11:05:22; UBX Wiki: https://wiki.u-blox.com/bin/view/Operations/PartDetails?index=8114; Perferred: N/A; RefDes: R; Mfg P/N Datasheet: https://wiki.u-blox.com/bin/view/Generic/Docs/DocumentSummary?index=8222; Manufacturer 2: ROHM; Manufacturer P/N 2: MCR01MZPF1003; Mfg P/N Status 2: Active; Mfg P/N Split 2: 0; Mfg P/N Released 2: Yes; Mfg P/N Datasheet 2: https://wiki.u-blox.com/bin/view/Generic/Docs/DocumentSummary?index=8186
R8 R9 R11 R13 R20 R21 = UBXH18-0007073: RES THICK FILM CHIP 0603 1K0 5% 100mW; Manufacturer: YAGEO; Manufacturer P/N: RC0603JR-071KL; Editor: roland.rust; Env: ROHS; Permitted Use: Volume Products; Perferred: PREF; Mfg P/N Status: Active; Mfg P/N Split: 100; Mfg P/N Released: Yes; Part Number: UBXH18-0007073; Tolerance: 5%; Max Power: 100mW; Part Type: Resistor; Released by: roland.rust; Release Data: 2008-06-24T15:59:29; UBX Wiki: https://wiki.u-blox.com/bin/view/Operations/PartDetails?index=6701; RefDes: R; Manufacturer 2: ROHM; Manufacturer P/N 2: MCR03EZPJ102; Mfg P/N Status 2: Active; Mfg P/N Split 2: 0; Mfg P/N Released 2: Yes
R10 R12 R14 R17 = UBXH18-0008049: RES THICK FILM CHIP 0402 1K0 5% 100mW; Manufacturer: YAGEO; Manufacturer P/N: 2322_705_70102_L; Editor: roland.rust; Env: ROHS; Permitted Use: Volume Products; Perferred: PREF; Mfg P/N Status: Obsolete; Mfg P/N Split: 100; Mfg P/N Released: Yes; Part Number: UBXH18-0008049; Tolerance: 5%; Max Power: 100mW; Part Type: Resistor; Released by: roland.rust; Release Data: 2005-07-22T13:59:44; UBX Wiki: https://wiki.u-blox.com/bin/view/Operations/PartDetails?index=6939; RefDes: R; Manufacturer 2: KOA; Manufacturer P/N 2: RK73B1ETTD102J; Mfg P/N Status 2: NRND; Mfg P/N Split 2: 0; Mfg P/N Released 2: Yes
TP14-TP16 = TP10R: as TP2 on sheet USB-IRIS-W1_INTERFACE; Part Number: TP10R; Size: 1.0mm; Height: 0; DNP: DNP; Added Date: 2/1/2015; Checked By: Paul B; Checked Date: 2/5/2015
U1 = UBXH12-0000160: STEP DOWN DC-DC CONVERTER 3-17V 3A TPS62132 3V3; Manufacturer: Texas Instruments; PartNumber: TPS62132RGTR; Manufacturer P/N: TPS62132RGTT; Switch Current Limit(Typ)(A): 4.2; Vout(Max)(V): 3.3; Iout(Max)(A): 3; Regulated Outputs(#): 1; Rating: Catalog; Vin(Max)(V): 17; Synchronous Rectification: TRUE; SubFamily: Step-Down Regulator; Eco-Plan: Green (RoHS & no Sb/Br); Duty Cycle(Max)(%): 100; Iq(Typ)(mA): 0.017; Topology: Buck; Editor: andre.pick; Released by: alvaro.nussbaum; Env: GREEN; Permitted Use: Support Products; Perferred: PREF; Mfg P/N Status: Active; Mfg P/N Released: Yes; DatasheetVersion: SLVSAG7; ComponentLink3Description: URL Link1; ComponentLink1Description: Datasheet; Vin(Min)(V): 3; PackageDescription: 16-Pin Plastic Quad Flat No-Lead, 3 x 3 mm Body, 0.5 mm Pitch, 1.7 x 1.7 mm Exposed Pad; Mounting Technology: Surface Mount; Preset Vout(V): 3.3; Code_JEDEC: MO-220; ComponentLink1URL: http://www.ti.com/general/docs/lit/getliterature.tsp?genericPartNumber=TPS62132&fileType=pdf; Vout(Min)(V): 3.3; ComponentLink2URL: http://www.ti.com/litv/pdf/mpqf119g; ComponentLink2Description: Package Specification; PackageReference: RGT0016C; PackageVersion: revH, Oct-2011; ComponentLink3URL: Samples URL:http://www.ti.com/product/tps62132#samples; Part Number: UBXH12-0000160; Value: 3V3; Min Operating Temp: -40°C; Max Operating Temp: 85°C; Part Type: Regulator; Release Data: 2021-03-11T12:33:47; UBX Wiki: https://wiki.u-blox.com/bin/view/Operations/PartDetails?index=22570; RefDes: U; Mfg P/N Split: 100; Mfg P/N Datasheet: https://wiki.u-blox.com/bin/view/Generic/Docs/DocumentSummary?index=19244; Manufacturer Part Number: TPS62132RGTR
U2 = UBXH10-0000054: FTDI USB TO SERIAL FULL UART INTERFACE QFN20; Manufacturer: FTDI Future Technology Devices International; Editor: adam.johansson; Env: ROHS; Permitted Use: Support Products; Perferred: PREF; Mfg P/N Status: Active; Mfg P/N Split: 100; Mfg P/N Released: No; Part Number: UBXH10-0000054; Value: FT231XQ-R; Min Operating Temp: -40°C; Max Operating Temp: 85°C; Part Type: Interface; UBX Wiki: https://wiki.u-blox.com/bin/view/Operations/PartDetails?index=27258; RefDes: U; Manufacturer P/N: FT231XQ-R; Mfg P/N Datasheet: https://wiki.u-blox.com/bin/view/Generic/Docs/DocumentSummary?index=33707

## Nets that join several sheets
+3V3: USB-IRIS-W1_INTERFACE (11 pins), USB-IRIS-W1_MODULE (9 pins), USB-IRIS-W1_POWER&COMM (12 pins)
GND: USB-IRIS-W1_INTERFACE (25 pins), USB-IRIS-W1_MODULE (60 pins), USB-IRIS-W1_POWER&COMM (23 pins)
VBUS: USB-IRIS-W1_MODULE (J1.1), USB-IRIS-W1_POWER&COMM (C6.1 D1.5 D3.A F1.2)
VBUS_OUT: USB-IRIS-W1_INTERFACE (C19.1 J5.27), USB-IRIS-W1_POWER&COMM (F1.1 J2.1)
VIN: USB-IRIS-W1_INTERFACE (C16.1 J5.30), USB-IRIS-W1_POWER&COMM (D2.A)
EXT_GNT: USB-IRIS-W1_INTERFACE (SW4.2), USB-IRIS-W1_MODULE (M1.M12)
EXT_REQ: USB-IRIS-W1_INTERFACE (SW4.3 TP2.1), USB-IRIS-W1_MODULE (M1.N12)
GPIO11/UART3-DTR: USB-IRIS-W1_INTERFACE (J5.9), USB-IRIS-W1_MODULE (M1.A11), USB-IRIS-W1_POWER&COMM (R21.2)
GPIO12/UART3-DSR: USB-IRIS-W1_INTERFACE (J5.10), USB-IRIS-W1_MODULE (M1.B10), USB-IRIS-W1_POWER&COMM (R20.2)
GPIO42/BLUE: USB-IRIS-W1_MODULE (M1.M8), USB-IRIS-W1_POWER&COMM (R2.2)
GPIO43/GREEN: USB-IRIS-W1_MODULE (M1.N8), USB-IRIS-W1_POWER&COMM (R4.2)
GPIO44/RED: USB-IRIS-W1_MODULE (M1.M7), USB-IRIS-W1_POWER&COMM (R7.2)
GPIO45: USB-IRIS-W1_INTERFACE (J5.19), USB-IRIS-W1_MODULE (M1.N7)
GPIO46: USB-IRIS-W1_INTERFACE (J5.20), USB-IRIS-W1_MODULE (M1.M6)
GPIO47: USB-IRIS-W1_INTERFACE (J5.21), USB-IRIS-W1_MODULE (M1.N6)
GPIO48: USB-IRIS-W1_INTERFACE (J5.22), USB-IRIS-W1_MODULE (M1.M5)
GPIO49: USB-IRIS-W1_INTERFACE (J5.25), USB-IRIS-W1_MODULE (M1.N5)
GPIO56/D3: USB-IRIS-W1_INTERFACE (J5.6), USB-IRIS-W1_MODULE (M1.L2)
GPIO57/D4: USB-IRIS-W1_INTERFACE (J5.7), USB-IRIS-W1_MODULE (M1.L1)
GPIO58/D5: USB-IRIS-W1_INTERFACE (J5.8), USB-IRIS-W1_MODULE (M1.K2)
GPIO61: USB-IRIS-W1_INTERFACE (J5.26), USB-IRIS-W1_MODULE (M1.K3)
GPIO62/D2: USB-IRIS-W1_INTERFACE (J5.5), USB-IRIS-W1_MODULE (M1.M1)
I2C-SCL: USB-IRIS-W1_INTERFACE (J5.24 R18.1), USB-IRIS-W1_MODULE (M1.B5)
I2C-SDA: USB-IRIS-W1_INTERFACE (J5.23 R5.1), USB-IRIS-W1_MODULE (M1.A6)
JTAG-nTRST: USB-IRIS-W1_INTERFACE (J3.10 J4.10), USB-IRIS-W1_MODULE (M1.B11)
JTAG-TCK: USB-IRIS-W1_INTERFACE (R19.1), USB-IRIS-W1_MODULE (M1.B14)
JTAG-TDI: USB-IRIS-W1_INTERFACE (J3.8 J4.8), USB-IRIS-W1_MODULE (M1.B12)
JTAG-TDO: USB-IRIS-W1_INTERFACE (J3.6 J4.6), USB-IRIS-W1_MODULE (M1.A12)
JTAG-TMS: USB-IRIS-W1_INTERFACE (R22.1), USB-IRIS-W1_MODULE (M1.A14)
QSPI_RCE: USB-IRIS-W1_INTERFACE (U3.1), USB-IRIS-W1_MODULE (M1.A5)
QSPI_RCLK: USB-IRIS-W1_INTERFACE (U3.6), USB-IRIS-W1_MODULE (M1.A2)
QSPI_RD0: USB-IRIS-W1_INTERFACE (U3.5), USB-IRIS-W1_MODULE (M1.B4)
QSPI_RD1: USB-IRIS-W1_INTERFACE (U3.2), USB-IRIS-W1_MODULE (M1.A4)
QSPI_RD2: USB-IRIS-W1_INTERFACE (U3.3), USB-IRIS-W1_MODULE (M1.B3)
QSPI_RD3: USB-IRIS-W1_INTERFACE (U3.7), USB-IRIS-W1_MODULE (M1.A3)
RESET: USB-IRIS-W1_INTERFACE (5 pins), USB-IRIS-W1_MODULE (M1.L5)
SPI-CLK: USB-IRIS-W1_INTERFACE (J5.16), USB-IRIS-W1_MODULE (M1.M9)
SPI-CS: USB-IRIS-W1_INTERFACE (J5.13), USB-IRIS-W1_MODULE (M1.M11)
SPI-MISO: USB-IRIS-W1_INTERFACE (J5.15), USB-IRIS-W1_MODULE (M1.N10)
SPI-MOSI: USB-IRIS-W1_INTERFACE (J5.14), USB-IRIS-W1_MODULE (M1.M10)
SW_BT1: USB-IRIS-W1_INTERFACE (C12.1 R24.1 SW1.1 TP8.1), USB-IRIS-W1_MODULE (M1.N4)
SW_BT2: USB-IRIS-W1_INTERFACE (C13.1 R25.1 SW2.1 TP10.1), USB-IRIS-W1_MODULE (M1.M3)
UART3-CTS: USB-IRIS-W1_INTERFACE (J5.12), USB-IRIS-W1_MODULE (M1.A9), USB-IRIS-W1_POWER&COMM (R11.2)
UART3-RTS: USB-IRIS-W1_INTERFACE (J5.11), USB-IRIS-W1_MODULE (M1.B8), USB-IRIS-W1_POWER&COMM (R13.2)
UART3-RXD: USB-IRIS-W1_INTERFACE (J5.2), USB-IRIS-W1_MODULE (M1.B9), USB-IRIS-W1_POWER&COMM (R8.2)
UART3-TXD: USB-IRIS-W1_INTERFACE (J5.1), USB-IRIS-W1_MODULE (M1.A10), USB-IRIS-W1_POWER&COMM (R9.2)
USB_IOD_N: USB-IRIS-W1_MODULE (M1.E1), USB-IRIS-W1_POWER&COMM (R17.1)
USB_IOD_P: USB-IRIS-W1_MODULE (M1.F1), USB-IRIS-W1_POWER&COMM (R10.2)

## Assembly variants
USB-IRIS-W106: not fitted C2 C10 C11 C20 C21 J3 J5 R10 R17 R19 R22 R23 R51 R52 U3